# EasyEDA Pro project luoye-recorder-pcb-2026-07-16.epro, board MIC BOARD
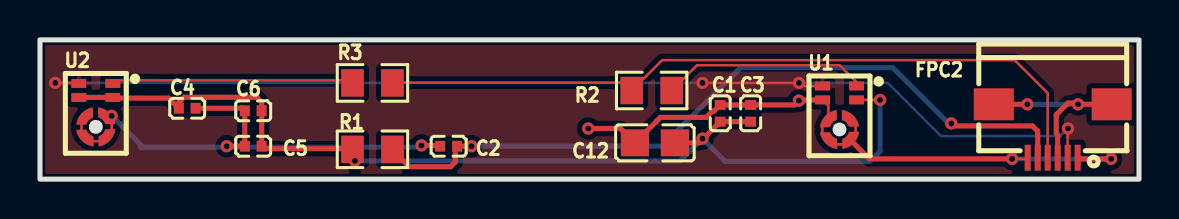
[diagram p4: board, top side]
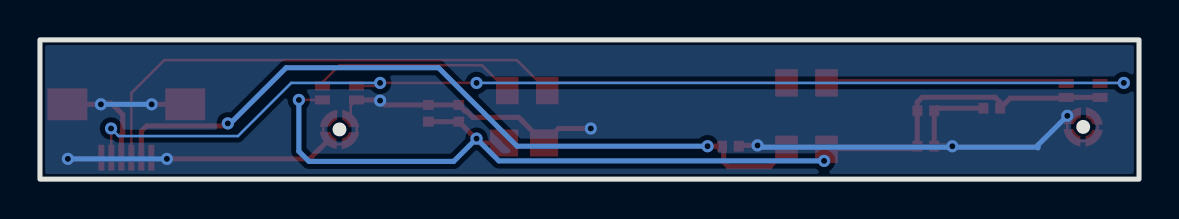
[diagram p5: board, bottom side, seen from below]

Outline 54.99 x 6.98 mm; copper layers: Top Layer, Bottom Layer. Coordinates in mm from the lower left corner of the outline.
Outline path: rectangle 0,6.98 54.99,0
Stack: Top Layer 0.035mm / Dielectric1 1.51mm FR4 er 4.5 / Bottom Layer 0.035mm

## Design rules (mm)
spacing copperThickness1oz (default): track to track 0.102, other pairs 0.152 to 0.3
spacing copperThickness2oz: track to track 0.203, other pairs 0.152 to 0.3
track width copperThickness1oz (default): min 0.127, default 0.254, max 2.54
track width copperThickness2oz: min 0.203, default 0.254, max 2.54
differential pair differentialPair (default): width min 0.127, default 0.254, max 2.54; gap min 0.152, default 0.152
net AGND uses copperRegion
net PDM_CLK uses copperRegion

## Placement (name value [footprint] x y rotation side)
C1  1uF  [C0402]  34.04 3.3 270 top
C2  1uF  [C0402]  20.45 1.65 0 top
C3  100nF  [C0402]  35.56 3.3 270 top
C4  1uF  [C0402]  7.37 3.56 0 top
C5  100nF  [C0402]  10.67 1.65 180 top
C6  100nF  [C0402]  10.67 3.43 0 top
C12  4.7uF  [C0805]  30.77 1.82 0 top
FPC2  AFC01-S06FCA-00  [FPC-SMD_P0.50-6P_AFC01-S06FCA-00]  50.67 2.41 180 top
R1  10Ω  [R0805]  16.64 1.49 180 top
R2  10Ω  [R0805]  30.61 4.45 0 top
R3  10Ω  [R0805]  16.64 4.83 0 top
U1  IM72D128V01XTMA1  [MIC-SMD_5P-L4.0-W3.0-P0.70-TR_IM69D130V01]  40.01 3.3 0 top
U2  IM72D128V01XTMA1  [MIC-SMD_5P-L4.0-W3.0-P0.70-TR_IM69D130V01]  2.79 3.43 0 top

## Footprints (pads in the part's own frame, mm; a bottom-side part is the same pattern mirrored in y, then rotated)
C0402
  rect 0.5x0.54 smd: 1(-0.42,0) 2(0.42,0)
C0805
  rect 1.41x1.35 smd: 1(-1,0) 2(1,0)
FPC-SMD_P0.50-6P_AFC01-S06FCA-00
  rect 0.3x1.3 smd: 1(-1.248,1.339) 2(-0.748,1.339) 3(-0.248,1.339) 4(0.252,1.339) 5(0.752,1.339) 6(1.252,1.339)
  rect 2x1.6 smd: 7(-2.95,-1.339) 8(2.95,-1.339)
MIC-SMD_5P-L4.0-W3.0-P0.70-TR_IM69D130V01
  rect 0.75x0.45 smd: 1(0.85,1.37) 2(0.85,0.67) 3(-0.85,1.37) 4(-0.85,0.67)
  custom 0.84x0.87 smd: 5(-0.56,-0.265) 5(0.56,-1.355)
  custom 0.87x0.84 smd: 5(-0.545,-1.37) 5(0.545,-0.25)
R0805
  rect 1.133x1.377 smd: 1(-1,0) 2(1,0)

## Nets
3.3V_MIC: C2.2 FPC2.5 R1.1
3.3V_MIC_FILT: C1.2 C3.2 C4.1 C5.1 C6.2 C12.2 R1.2 U1.2 U2.2 U2.4
AGND: C1.1 C2.1 C3.1 C4.2 C5.2 C6.1 C12.1 FPC2.1 FPC2.3 FPC2.6 FPC2.7 FPC2.8 U1.4 U1.5 U2.5
PDM_CLK: FPC2.2 U1.3 U2.3
PDM_DATA: FPC2.4 R2.1 R3.2
$1N28: R2.2 U1.1
$1N31: R3.1 U2.1

## Via types
v1: diameter 0.61, hole 0.305, Top Layer to Bottom Layer, 18 vias

## Routing (per net, layer and track width the routed paths; a pad name or vN(x,y) marks a point on that pad's centre or on a via; arc(x,y) is an arc through that point)
3.3V_MIC: length 37.1
  Top Layer w0.254: 17.9,1.2 18.47,0.62 20.55,0.62 20.78,0.86 20.78,1.44 ; C2.2 v1(21.59,1.65) ; v1(45.59,2.79) 45.72,2.67 49.66,2.67 49.92,2.4 FPC2.5
  Bottom Layer w0.254: v1(45.59,2.79) 45.47,2.79 42.67,5.59 35.05,5.59 31.11,1.65 v1(21.59,1.65)
3.3V_MIC_FILT: length 51.8
  Top Layer w0.127: U1.2 v1(42.04,3.97)
  Top Layer w0.254: C12.2 32.97,1.82 C1.2 C3.2 ; 11.14,1.53 15.34,1.53 15.42,1.61 ; U2.4 3.64,4.1 3.68,4.06 6.44,4.06 C4.1 6.95,3.85 7.2,4.11 10.85,4.11 11.09,3.86 11.09,1.66
  Bottom Layer w0.254: v1(42.04,3.97) 42.04,1.4 41.53,0.89 34.29,0.89 v1(33.15,2.03) 32.03,0.92 v1(15.76,0.92)
AGND: length 66.1
  Top Layer w0.127: FPC2.6 49.36,1.02 v1(48.64,1.02) ; 3.16,1.97 3.1,1.91 2.5,1.91 2.47,1.93 ; 3.48,2.3 3.59,2.4 v1(3.59,3.17) 3.59,3.19 3.54,3.24 ; 2.08,3 2.08,2.33 2.3,2.11 ; 2.5,3.33 2.37,3.21 2.32,3.21 ; 40.74,2.22 40.81,2.29 40.81,2.85 ; 39.23,2.16 39.14,2.24 39.14,2.68 ; U1.5 39.45,3.68 U1.4 ; 40.35,1.73 40.33,1.75 39.7,1.75
  Top Layer w0.254: 10.02,1.66 9.3,1.66 9.28,1.64 ; v1(27.43,2.54) 29.05,2.54 C12.1 30.86,2.91 30.86,2.92 31.04,3.1 33.34,3.1 33.65,3.41 33.73,3.41 C1.1 C3.1 37.76,3.72 v1(37.97,3.94) 38.01,3.97 U1.4 ; FPC2.7 v1(51.94,3.75) 51.88,3.82 51.44,3.82 50.85,3.23 50.85,2.3 50.92,2.23 FPC2.3 ; v1(53.59,1.02) 51.98,1.02 FPC2.1 ; 19.95,1.69 v1(19.09,1.69) ; 7.79,3.56 10.12,3.56 C6.1 C5.2 ; v1(48.64,1.02) 41.5,1.02 U1.5 ; FPC2.8 v1(49.4,3.75)
  Bottom Layer w0.254: 5.06,1.6 5.06,1.56 ; 5.06,1.6 5.06,1.7 v1(3.59,3.17) ; 5.06,1.6 9.33,1.6 ; 18.91,1.6 9.35,1.6 9.33,1.61 ; v1(48.64,1.02) v1(53.59,1.02) ; v1(49.4,3.75) v1(51.94,3.75)
  vias: v1(9.34,1.65)
PDM_CLK: length 55.8
  Top Layer w0.127: v1(51.44,2.54) 51.42,2.53 FPC2.2 ; U2.3 1.92,4.83 v1(0.76,4.83) ; v1(33.15,4.83) v1(37.97,4.83) 38.13,4.67 U1.3
  Bottom Layer w0.127: v1(37.97,4.83) 42.42,4.83 45.08,2.16 51.05,2.16 v1(51.44,2.54) ; v1(0.76,4.83) v1(33.15,4.83)
PDM_DATA: length 37.4
  Top Layer w0.127: 17.72,4.84 29.21,4.84 R2.1 31.13,5.97 48.77,5.97 50.42,4.32 50.42,1.08 FPC2.4
$1N28: length 10.3
  Top Layer w0.127: R2.2 32.88,5.72 40.01,5.72 40.86,4.86 U1.1
$1N31: length 12
  Top Layer w0.127: 15.6,4.96 3.81,4.96 3.69,4.84

## Copper pours and planes (outline as drawn; the poured copper is in the pictures)
AGND on Bottom Layer: 0.04,7.01 55.08,7.01 55.08,0 0.04,0
PDM_CLK on Top Layer: 0.1,6.98 54.94,6.98 54.94,-0.07 0.1,-0.07
